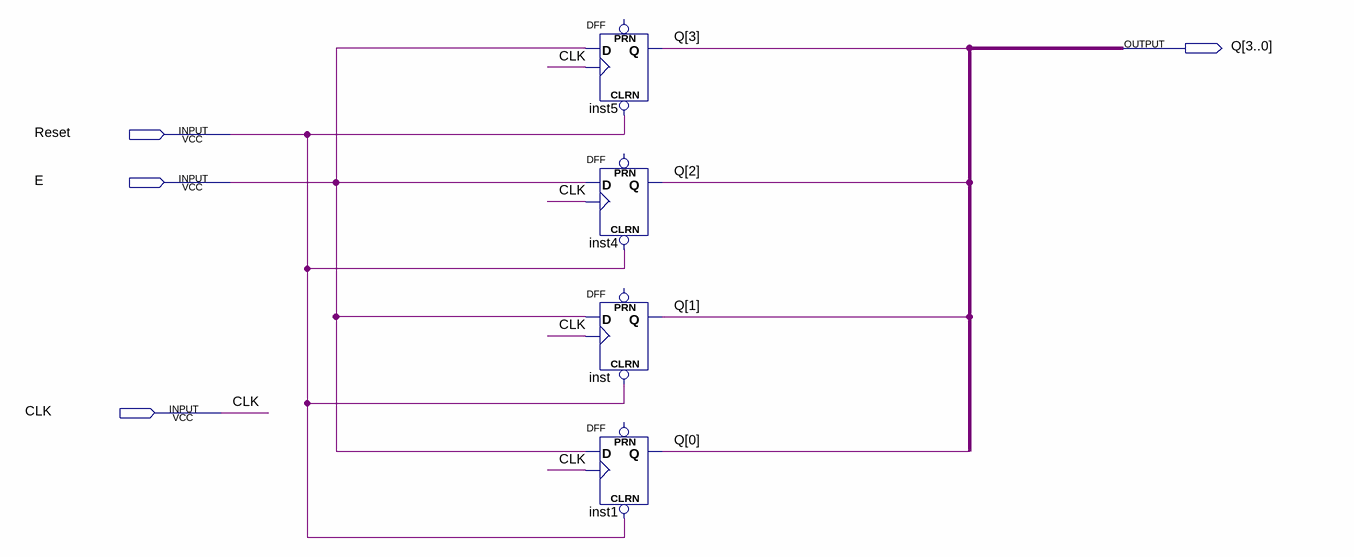
[diagram p0: schematic sheet]
// Quartus schematic front.bdf as structural Verilog: 4 symbols, 4 pins
module front (
  input  Reset,
  input  E,
  input  CLK,
  output [3:0] Q
);

  DFF inst5 (.CLRN(Reset), .CLK(CLK), .D(E), .Q(Q[3]));  // open: PRN
  DFF inst4 (.CLRN(Reset), .CLK(CLK), .D(E), .Q(Q[2]));  // open: PRN
  DFF inst (.CLRN(Reset), .CLK(CLK), .D(E), .Q(Q[1]));  // open: PRN
  DFF inst1 (.CLRN(Reset), .CLK(CLK), .D(E), .Q(Q[0]));  // open: PRN
endmodule
